# EAGLE schematic Tape_Sensor_Circuit (EAGLE 9.3.0)
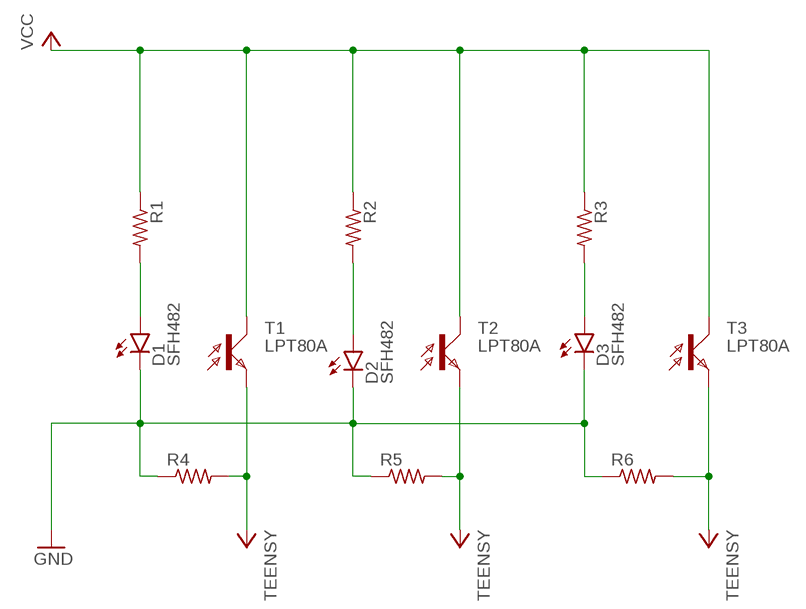
[diagram p0: schematic, sheet 1]

## Parts
D1  SFH482  [SFH482]
D2  SFH482  [SFH482]
D3  SFH482  [SFH482]
R1  R-US_0204/2V  [0204V]
R2  R-US_0204/2V  [0204V]
R3  R-US_0204/2V  [0204V]
R4  R-US_0204/2V  [0204V]
R5  R-US_0204/2V  [0204V]
R6  R-US_0204/2V  [0204V]
T1  LPT80A  [LPT80A]
T2  LPT80A  [LPT80A]
T3  LPT80A  [LPT80A]

## Nets
GND: D1.K(C) D2.K(C) D3.K(C) R4.1 R5.1 R6.1
N$1: D1.A R1.2
N$2: D3.A R3.2
N$3: D2.A R2.2
VCC: R1.1 R2.1 R3.1 R4.2 R5.2 R6.2 T1.C T1.E T2.C T2.E T3.C T3.E ; supply symbol labelled TEENSY

## Library data of the parts
D1-D3 = led:SFH482: IR LED infrared emitting diode, Infineon
R1-R6 = rcl:R-US_: RESISTOR, American symbol; SPICEPREFIX: R
T1-T3 = opto-trans-siemens:LPT80A: PHOTO TRANSISTOR; OC_FARNELL: unknown; OC_NEWARK: unknown